# EAGLE board nrf52_dev (EAGLE 9.6.2), part 1 of 2
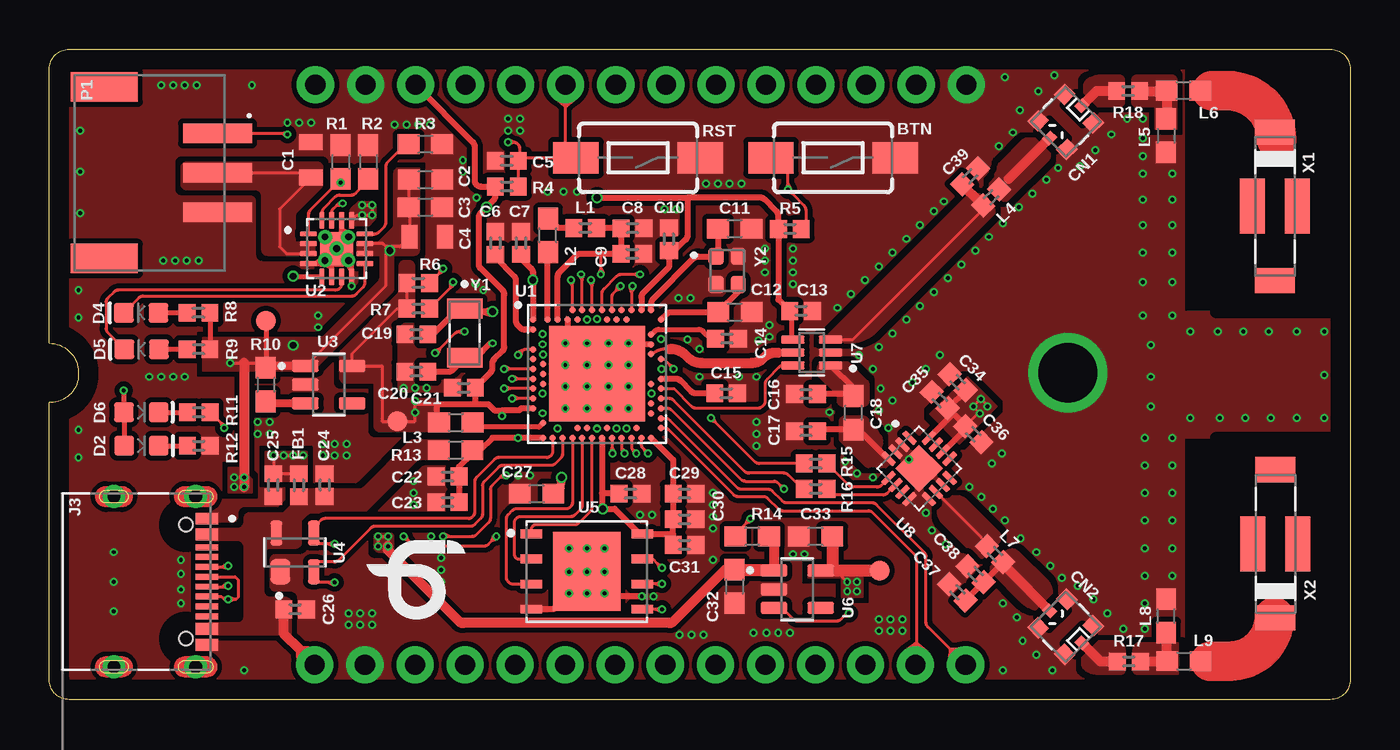
[diagram p1: board, top side]
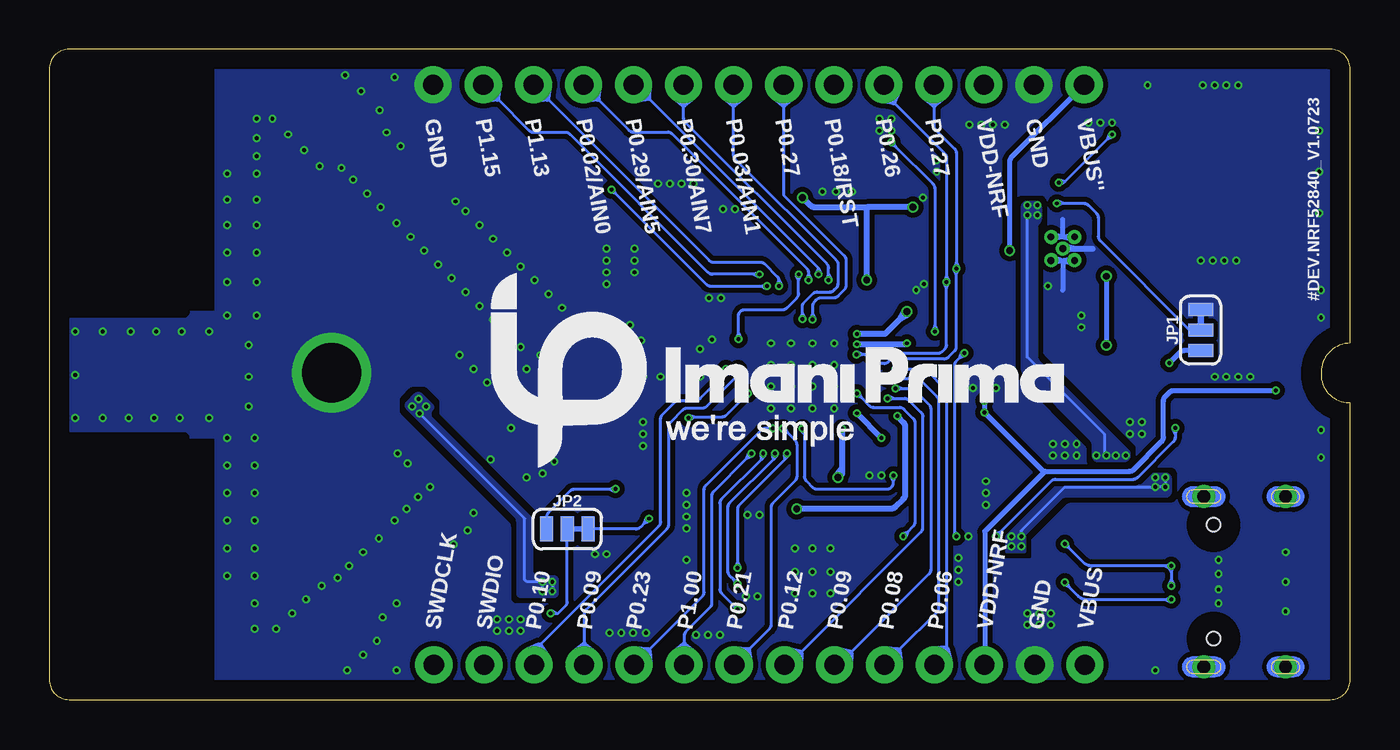
[diagram p2: board, bottom side, seen from below]

Size 66 x 33 mm. Coordinates in mm from the lower left corner, seen from the top.
Outline: 66,32 66,1 arc-90 65,0 1,0 arc-90 0,1 0,15.08 0.07,15.08 arc90 1.48,16.49 1.48,16.6 arc90 0,18.08 0,32 arc-90 1,33 65,33 arc-90 66,32
Copper layers (1*16): Top 0.035mm / dielectric 1.5mm / Bottom 0.035mm
Design rules "default *": minimum track width 6mil, minimum drill 0.35mm, track to track 5mil, track to pad 6mil, pad to pad 6mil, via to via 6mil, smd to smd 6mil, copper to edge 40mil, drill to drill 6mil, minimum pad ring 10mil, minimum via ring 4mil, stop-mask expansion 4mil, vias tented up to drill 25mil, thermal gap 10mil

## Footprints (pad centres in the part's own frame; a part is rotated, then mirrored left to right if it is on the bottom)
TACTILE_SWITCH_SMD_6.0X3.5MM = smd 2.3 x 1.6: 1 -3.15,0; 2 3.15,0
0805 = smd 0.8 x 1.2: 1 -0.9,0; 2 0.9,0
0603 = smd 1.1 x 1: 1 -0.85,0; 2 0.85,0
0402 = smd 0.85 x 0.9: 1 -0.58,0; 2 0.58,0
MM8130-2600 = smd 0.75 x 0.8: 1 -1.025,0.95; 2 1.025,0.95; 3 -1.025,-0.95; 4 1.025,-0.95 | smd 0.5 x 0.58: IN 0,1.16; OUT 0,-1.16
LED-0603 = smd 1 x 1: A -0.877,0; C 0.877,0
1X14_NO_SILK = drill 1.016 pad 1.88: 1 0,0; 2 2.54,0; 3 5.08,0; 4 7.62,0; 5 10.16,0; 6 12.7,0; 7 15.24,0; 8 17.78,0; 9 20.32,0; 10 22.86,0; 11 25.4,0; 12 27.94,0; 13 30.48,0; 14 33.02,0
KINGHELM_KH-TYPE-C-16P = smd 0.6 x 1.15: A1_B12 -3.2,4.725; A4_B9 -2.4,4.725; A9_B4 2.4,4.725; A12_B1 3.2,4.725 | smd 0.3 x 1.15: A5 -1.25,4.725; A6 -0.25,4.725; A7 0.25,4.725; A8 1.25,4.725; B5 1.75,4.725; B6 0.75,4.725; B7 -0.75,4.725; B8 -1.75,4.725 | drill 0.65 pad 1.05: SH1 -4.32,0; SH2 4.32,0; SH3 -4.32,4.15; SH4 4.32,4.15 | hole 0.7: -2.89,3.65; 2.89,3.65
SMT-JUMPER_3_1-NC_TRACE_SILK = smd 0.66 x 1.27: 1 -1.041,0; 2 0,0; 3 1.041,0
JST_S3B-PH-SM4-TB = smd 1 x 3.5: 1 2,0; 2 0,0; 3 -2,0 | smd 1.5 x 3.4: P1 4.35,5.75; P2 -4.35,5.75
PAD.03X.04 = smd 1.016 x 1.016: P$1 0,0
NORDIC_NRF52840-QIAA-R7 = smd 0.33 x 0.33: A8 -1.25,3.25; A10 -0.75,3.25; A12 -0.25,3.25; A14 0.25,3.25; A16 0.75,3.25; A18 1.25,3.25; A20 1.75,3.25; A22 2.25,3.25; A23 2.75,3.25; AA24 3.25,-2.25; AB2 -2.75,-2.5; AC5 -2,-2.75; AC9 -1,-2.75; AC11 -0.5,-2.75; AC13 0,-2.75; AC15 0.5,-2.75; AC17 1,-2.75; AC19 1.5,-2.75; AC21 2,-2.75; AC24 3.25,-2.75; AD2 -2.75,-3.25; AD4 -2.25,-3.25; AD6 -1.75,-3.25; AD8 -1.25,-3.25; AD10 -0.75,-3.25; AD12 -0.25,-3.25; AD14 0.25,-3.25; AD16 0.75,-3.25; AD18 1.25,-3.25; AD20 1.75,-3.25; AD22 2.25,-3.25; AD23 2.75,-3.25; B1 -3.25,2.75; B3 -2.5,2.75; B5 -2,2.75; B7 -1.5,2.75; B9 -1,2.75; B11 -0.5,2.75; B13 0,2.75; B15 0.5,2.75; B17 1,2.75; B19 1.5,2.75; B24 3.25,2.75; C1 -3.25,2.25; D2 -2.75,2; D23 2.75,2; E24 3.25,1.75; F2 -2.75,1.5; F23 2.75,1.5; G1 -3.25,1.25; H2 -2.75,1; H23 2.75,1; J1 -3.25,0.75; J24 3.25,0.75; K2 -2.75,0.5; L1 -3.25,0.25; L24 3.25,0.25; M2 -2.75,0; N1 -3.25,-0.25; N24 3.25,-0.25; P2 -2.75,-0.5; P23 2.75,-0.5; R1 -3.25,-0.75; R24 3.25,-0.75; T2 -2.75,-1; T23 2.75,-1; U1 -3.25,-1.25; U24 3.25,-1.25; V23 2.75,-1.5; W1 -3.25,-1.75; W24 3.25,-1.75; Y2 -2.75,-2; Y23 2.75,-2 | smd 4.85 x 4.85: EXP 0,0
QFN50P300X300X100-17N = smd 0.86 x 0.26: 1 -1.435,0.75; 2 -1.435,0.25; 3 -1.435,-0.25; 4 -1.435,-0.75; 9 1.435,-0.75; 10 1.435,-0.25; 11 1.435,0.25; 12 1.435,0.75 | smd 0.26 x 0.86: 5 -0.75,-1.435; 6 -0.25,-1.435; 7 0.25,-1.435; 8 0.75,-1.435; 13 0.75,1.435; 14 0.25,1.435; 15 -0.25,1.435; 16 -0.75,1.435 | smd 1.68 x 1.68: 17 0,0 | drill 0.2 pad 0.4: 18 0,0; 19 -0.58,0.58; 20 0.58,0.58; 21 -0.58,-0.58; 22 0.58,-0.58
SOT95P285X140-5N = smd 1.35 x 0.6: 1 -1.185,0.95; 2 -1.185,0; 3 -1.185,-0.95; 4 1.185,-0.95; 5 1.185,0.95
SOT190P230X110-4N = smd 1.26 x 0.99: 1 -0.98,0.75 | smd 1.26 x 0.59: 2 -0.98,-0.95; 3 0.98,-0.95; 4 0.98,0.95
SON127P500X600X80-9N = smd 1.1 x 0.44: 1 -2.815,1.905; 2 -2.815,0.635; 3 -2.815,-0.635; 4 -2.815,-1.905; 5 2.815,-1.905; 6 2.815,-0.635; 7 2.815,0.635; 8 2.815,1.905 | smd 3.4 x 4: 9 0,0
SOT65P210X110-6N = smd 1.19 x 0.4: 1 -0.96,0.65; 2 -0.96,0; 3 -0.96,-0.65; 4 0.96,-0.65; 5 0.96,0; 6 0.96,0.65
QFN50P300X300X60-17N = smd 0.81 x 0.27: 1 -1.445,0.75; 2 -1.445,0.25; 3 -1.445,-0.25; 4 -1.445,-0.75; 9 1.445,-0.75; 10 1.445,-0.25; 11 1.445,0.25; 12 1.445,0.75 | smd 0.27 x 0.81: 5 -0.75,-1.445; 6 -0.25,-1.445; 7 0.25,-1.445; 8 0.75,-1.445; 13 0.75,1.445; 14 0.25,1.445; 15 -0.25,1.445; 16 -0.75,1.445 | smd 1.7 x 1.7: 17 0,0
2450AT43B100 = smd 1.27 x 2.032: 1 -3.759,0; 2 3.759,0 | smd 2.794 x 1.27: 3 0,-1.143; 4 0,1.143
XTAL_NX3215SA-32.768K-STD-MUA-8 = smd 1 x 1.8: 1 -1.25,0; 2 1.25,0
OSCCC200X160X45N = smd 0.78 x 0.88: 1 -0.565,0.715; 2 -0.565,-0.715; 3 0.565,-0.715; 4 0.565,0.715

## Placement (x,y rotation side)
BTN  BTN0  [TACTILE_SWITCH_SMD_6.0X3.5MM]  39.76,27.49 180 top
C1  4.7uF  [0805]  13.28,27.39 90 top
C2  100nF  [0603]  19.09,26.38 0 top
C3  1uF  [0603]  19.08,24.98 0 top
C4  4.7uF  [0805]  19.18,23.48 0 top
C5  100nF  [0402]  23.21,27.34 180 top
C6  100nF  [0402]  22.64,23.16 90 top
C7  1uF  [0402]  23.93,23.17 90 top
C8  1uF  [0402]  29.59,23.91 0 top
C9  47nF  [0402]  29.58,22.62 0 top
C10  100nF  [0402]  31.43,23.36 90 top
C11  12pF  [0603]  34.77,23.89 0 top
C12  12pF  [0603]  34.78,19.66 0 top
C13  100nF  [0402]  38.14,19.72 180 top
C14  100pF  [0402]  34.38,18.31 0 top
C15  820pF  [0402]  34.34,15.54 0 top
C16  NC  [0402]  38.38,15.51 180 top
C17  NC  [0402]  38.38,13.62 180 top
C18  1pF  [0603]  40.8,14.55 90 top
C19  12pF  [0402]  18.62,18.54 0 top
C20  12pF  [0402]  18.62,16.64 0 top
C21  4.7uF  [0402]  21.03,15.82 180 top
C22  4.7uF  [0402]  20.21,11.32 180 top
C23  4.7uF  [0402]  20.21,10.02 180 top
C24  10nF  [0402]  13.97,10.88 90 top
C25  100nF  [0402]  11.37,10.88 270 top
C26  100nF  [0402]  12.48,4.58 0 top
C27  4.7uF  [0603]  24.72,10.45 180 top
C28  100nF  [0402]  29.49,10.45 0 top
C29  100nF  [0402]  32.23,10.45 0 top
C30  100nF  [0402]  32.23,9.15 0 top
C31  4.7uF  [0402]  32.23,7.85 0 top
C32  1uF  [0603]  34.76,5.74 270 top
C33  1uF  [0603]  38.87,8.28 180 top
C34  2.2uF  [0402]  46.08,16.11 315 top
C35  220pF  [0402]  45.17,15.2 315 top
C36  100nF  [0402]  46.88,13.46 135 top
C37  NC  [0402]  46.07,5.44 135 top
C38  1.2pF  [0402]  46.99,6.36 135 top
C39  1.2pF  [0402]  46.72,26.55 45 top
CN1  MM8130-2600  [MM8130-2600]  51.57,29.32 135 top
CN2  MM8130-2600  [MM8130-2600]  51.57,3.69 45 top
D2  RED  [LED-0603]  4.68,12.88 0 top
D4  CHG/BLUE  [LED-0603]  4.66,19.63 180 top
D5  PGOOD/GREEN  [LED-0603]  4.69,17.78 180 top
D6  WHITE  [LED-0603]  4.67,14.58 0 top
FB1  120R/0.85A  [0402]  12.67,10.88 90 top
J2  [1X14_NO_SILK]  13.5,31.2 0 top
J3  KH-TYPE-C-16P  [KINGHELM_KH-TYPE-C-16P]  3.28,5.98 270 top
J4  [1X14_NO_SILK]  13.47,1.77 0 top
JP1  JP-SYSOFF  [SMT-JUMPER_3_1-NC_TRACE_SILK]  7.59,18.75 90 bottom
JP2  JP_EN1  [SMT-JUMPER_3_1-NC_TRACE_SILK]  39.72,8.65 0 bottom
L1  15nH  [0402]  27.19,23.93 0 top
L2  10uH  [0603]  25.3,23.56 90 top
L3  10uH  [0603]  20.62,14.06 0 top
L4  1.9nH  [0402]  47.78,25.48 45 top
L5  1.8nH  [0603]  56.65,28.61 270 top
L6  2.7nH  [0603]  57.54,30.9 0 top
L7  1.9nH  [0402]  47.98,7.38 315 top
L8  1.8nH  [0603]  56.66,4.25 90 top
L9  2.7nH  [0603]  57.56,1.95 0 top
P1  S3B-PH-SM4-TB  [JST_S3B-PH-SM4-TB]  8.54,26.73 90 top
R1  10K/NC  [0603]  14.78,27.28 270 top
R2  1K13  [0603]  16.18,27.28 270 top
R3  1K18  [0603]  19.08,28.18 180 top
R4  10k  [0402]  23.21,26.03 180 top
R5  10K  [0402]  37.57,23.88 180 top
R6  4K7  [0402]  18.72,21.14 0 top
R7  4K7  [0402]  18.72,19.84 0 top
R8  1k5  [0402]  7.57,19.63 0 top
R9  1k5  [0402]  7.58,17.78 0 top
R10  10K  [0603]  10.98,15.98 270 top
R11  2K2  [0402]  7.59,14.58 0 top
R12  2K2  [0402]  7.59,12.88 0 top
R13  4R7  [0603]  20.62,12.66 0 top
R14  10K  [0603]  35.66,8.28 180 top
R15  1K  [0402]  38.88,11.98 0 top
R16  1K  [0402]  38.88,10.69 0 top
R17  0  [0402]  54.77,1.93 0 top
R18  0  [0402]  54.73,30.88 0 top
RST  RST  [TACTILE_SWITCH_SMD_6.0X3.5MM]  29.87,27.49 180 top
TP1  TP_VDD_FE  [PAD.03X.04]  42.13,6.53 0 top
TP2  TP_VDD_NRF  [PAD.03X.04]  17.65,14.12 0 top
TP3  TP_VBUS''  [PAD.03X.04]  10.99,19.22 0 top
U1  NRF52840-QIAA-R7  [NORDIC_NRF52840-QIAA-R7]  27.79,16.53 0 top
U2  BQ24075RGTR  [QFN50P300X300X100-17N]  14.58,22.88 0 top
U3  AP7366-33W5-7  [SOT95P285X140-5N]  14.18,15.98 0 top
U4  PRTR5V0U2X  [SOT190P230X110-4N]  12.47,7.47 90 top
U5  MX25L12833FZNI-10G  [SON127P500X600X80-9N]  27.27,6.5 0 top
U6  AP7366-33W5-7  [SOT95P285X140-5N]  37.95,5.6 0 top
U7  PE4259  [SOT65P210X110-6N]  38.68,17.61 180 top
U8  RFX2401C  [QFN50P300X300X60-17N]  44.13,11.73 315 top
U$1  [IP_S]  43.58,11.78 0 bottom
U$3  [IPS]  15.98,8.38 270 top
X1  2450AT43B100E  [2450AT43B100]  62.18,25.03 270 top
X2  2450AT43B100E  [2450AT43B100]  62.2,7.91 90 top
Y1  NX3215SA-32.768K-STD-MUA-8  [XTAL_NX3215SA-32.768K-STD-MUA-8]  21.07,18.59 270 top
Y2  CX2016DB32000D0WZRC1  [OSCCC200X160X45N]  34.39,21.77 0 top